# EasyEDA schematic SCH_PowerDistributionBoardV2_2022-03-02.json
TITLE: Sheet_1; REV: 1.0; Date: 2022-03-02; Sheet: 1/1; Drawn By: JunnH; Company: Your Company
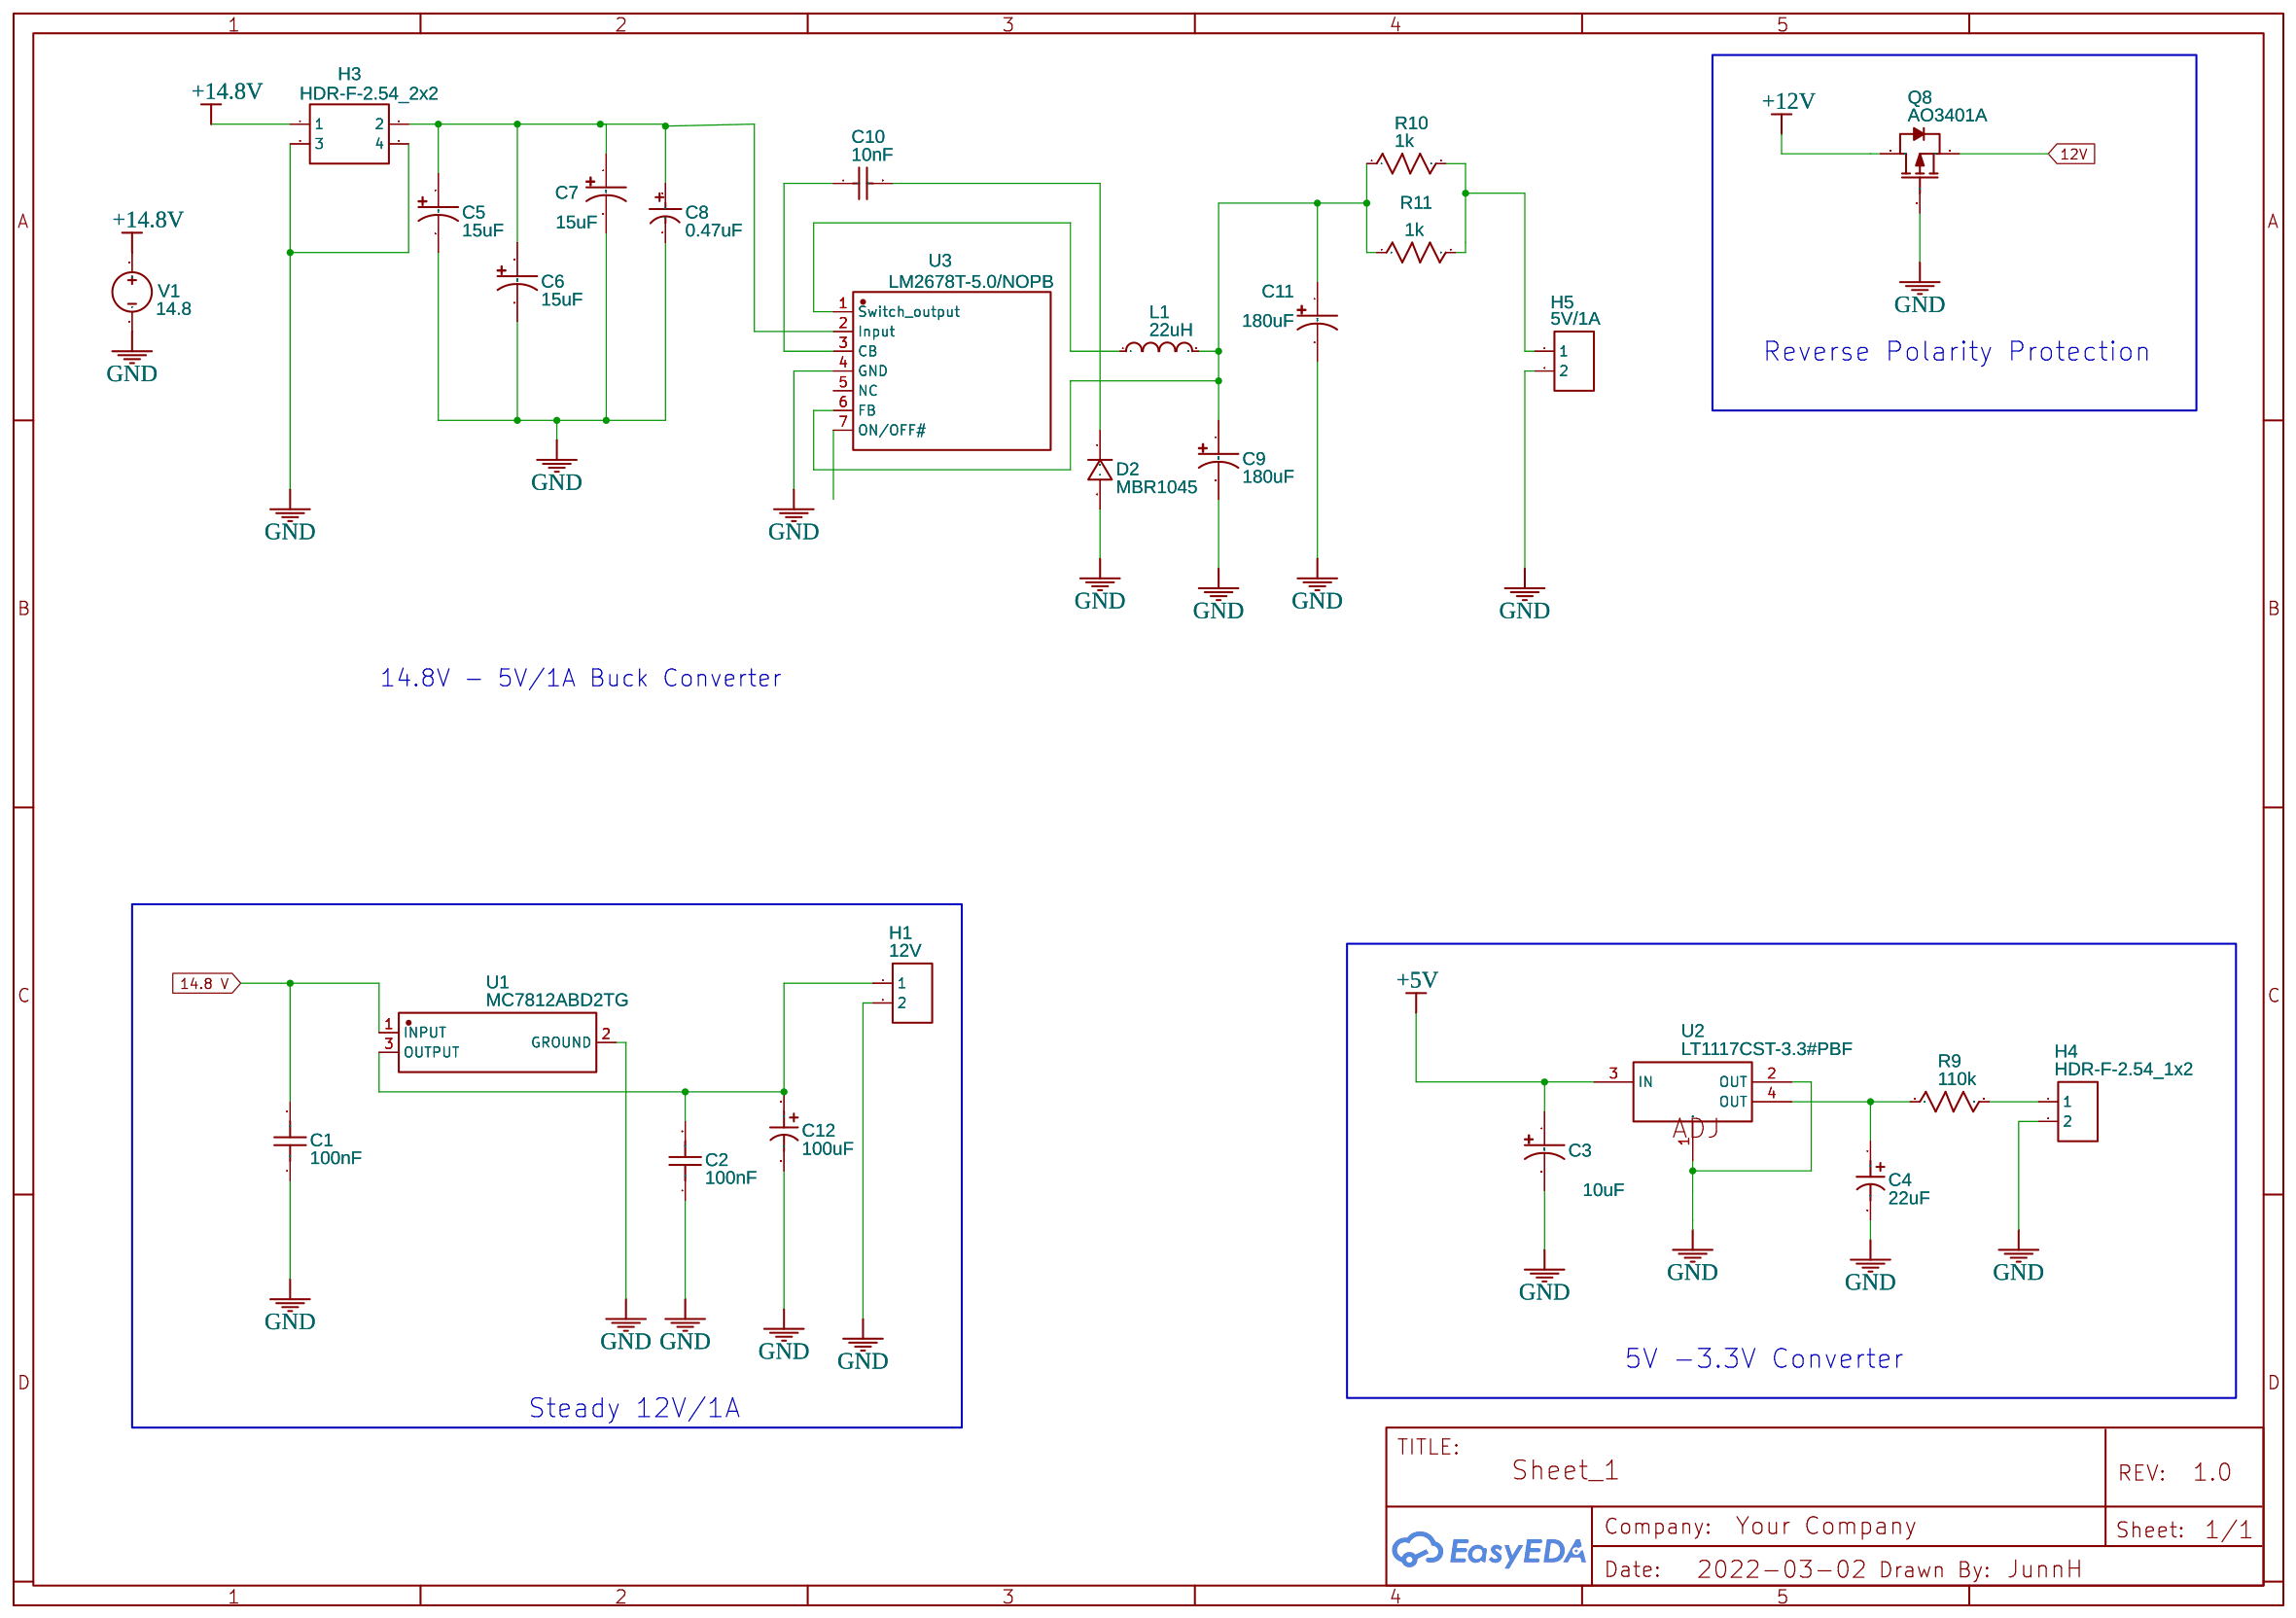
[diagram p0: schematic sheet]

## Parts
C1  100nF  [CAP-TH_L5.0-W2.5-P2.54-D0.7]
C2  100nF  [CAP-TH_L5.0-W2.5-P2.54-D0.7]
C3  10uF  [CAP-SMD_BD5.0-L5.3-W5.3-RD]
C4  22uF  [CAP-SMD_BD6.3-L6.6-W6.6-FD]
C5  15uF  [CAP-SMD_BD6.3-L6.6-W6.6-LS7.6-FD]
C6  15uF  [CAP-SMD_BD6.3-L6.6-W6.6-LS7.6-FD]
C7  15uF  [CAP-SMD_BD6.3-L6.6-W6.6-LS7.6-FD]
C8  0.47uF  [CAP-SMD_BD4.0-L4.3-W4.3-FD-LS5.3]
C9  180uF  [CAP-SMD_BD6.3-L6.6-W6.6-LS7.2-R-RD]
C10  10nF  [C0805]
C11  180uF  [CAP-SMD_BD6.3-L6.6-W6.6-LS7.2-R-RD]
C12  100uF  [CAP-SMD_BD6.3-L6.6-W6.6-LS7.4-FD]
D2  MBR1045  [TO-220AC_L10.0-W4.5-P5.08-T]
H1  12V  [HDR-F-2.54_1X2]
H3  HDR-F-2.54_2x2  [HDR-F-2.54_2X2]
H4  HDR-F-2.54_1x2  [HDR-F-2.54_1X2]
H5  5V/1A  [HDR-F-2.54_1X2]
L1  22uH  [IND-SMD_L7.1-W6.6]
Q8  AO3401A  [SOT-23_L2.9-W1.3-P1.90-LS2.4-BR]
R9  110k  [R0603]
R10  1k  [R0603]
R11  1k  [R0603]
U1  MC7812ABD2TG  [TO-263-2_L10.1-W9.1-P5.08-LS15.2-BR]
U2  LT1117CST-3.3#PBF  [SOT-223-3_L6.5-W3.4-P2.30-LS7.0-BR]
U3  LM2678T-5.0/NOPB  [TO-220-7-L10.5-W4.5-P1.27-BL]
V1  14.8  [HDR1X2]

## Library data of the parts
C1 C2 = CC1H104ZA19D3F5P10MF: Supplier: LCSC; Supplier Part: C254086; Manufacturer: Dersonic; Contributor: LCSC; JLCPCB Part Class: Extended Part
C3 = VE-100M1H0505-TRO: Supplier: LCSC; Supplier Part: C249452; Manufacturer: Lelon; Contributor: LCSC; JLCPCB Part Class: Extended Part
C4 = RVT22UF50V67RV0028: Supplier: LCSC; Supplier Part: C2836438; Manufacturer: KNSCHA(科尼盛); Contributor: LCSC
C5-C7 = UUD1H150MCL1GS: Supplier: LCSC; Supplier Part: C340748; Manufacturer: Nichicon; Contributor: LCSC; JLCPCB Part Class: Extended Part
C8 = CS1HR47M-CRC54: Supplier: LCSC; Manufacturer: SEMTECH; Contributor: LCSC; Supplier Part: C117834; JLCPCB Part Class: Extended Part
C9 C11 = VKMC1001C181MV: Supplier: LCSC; Supplier Part: C487303; Manufacturer: Ymin; Contributor: LCSC; JLCPCB Part Class: Extended Part
C10 = CL21B103KBANNNC: Supplier: LCSC; Manufacturer: SAMSUNG; Supplier Part: C1710; JLCPCB Part Class: Basic Part
C12 = RVT100UF35V67RV0034: Supplier: LCSC; Supplier Part: C2836442; Manufacturer: KNSCHA(科尼盛); Contributor: LCSC; JLCPCB Part Class: Extended Part
D2 = MBR1045: Supplier: LCSC; Supplier Part: C260253; Manufacturer: Sangdest Microelectronicstronic (Nanjing); Contributor: LCSC; JLCPCB Part Class: Extended Part
H1 H4 H5 = HDR-F-2.54_1x2: Supplier Part: C49661; Supplier: LCSC; Contributor: LCEDA_Lib
H3 = HDR-F-2.54_2x2: Supplier Part: C239342; Supplier: LCSC; Contributor: LCEDA_Lib
L1 = SLO0630H220MTT: Supplier: LCSC; Supplier Part: C207843; Manufacturer: Sunltech Tech; Contributor: LCSC; JLCPCB Part Class: Extended Part
Q8 = AO3401A: Supplier: LCSC; Manufacturer: AOS; Supplier Part: C15127; JLCPCB Part Class: Basic Part
R9-R11 = R_0603_US: Contributor: LCEDA_Lib
U1 = MC7812ABD2TG: Supplier: LCSC; Manufacturer: ON; Contributor: LCSC; Supplier Part: C154818; JLCPCB Part Class: Extended Part
U2 = LT1117CST-3.3#PBF: Supplier: LCSC; Supplier Part: C140395; Manufacturer: Linear Tech; Contributor: LCSC; JLCPCB Part Class: Extended Part
U3 = LM2678T-5.0/NOPB: Supplier: LCSC; Supplier Part: C390086; Manufacturer: Texas Instruments; Contributor: LCSC; JLCPCB Part Class: Extended Part
V1 = VDC: Contributor: EasyEDA; sim: true

## Nets
12V: Q8.2(S)
+5V: C3.1 U2.3(IN)
+12V: Q8.3(D)
+14.8V: H3.1 V1.1
GND: C1.1 C2.1 C3.2 C4.2 C5.2 C6.2 C7.2 C8.2 C9.2 C11.2 C12.2 D2.2(A) H1.2 H3.3 H3.4 H4.2 H5.2 Q8.1(G) U1.2(GROUND) U2.1(ADJ) U2.2(OUT) U3.4(GND) V1.2
14.8 V: C1.2 U1.1(INPUT)
Net-(C2-2): C2.2 C12.1 H1.1 U1.3(OUTPUT)
Net-(C4-1): C4.1 R9.1 U2.4(OUT)
Net-(C5-1): C5.1 C6.1 C7.1 C8.1 H3.2 U3.2(Input)
Net-(C9-1): C9.1 C11.1 L1.2 R10.1 R11.1 U3.6(FB)
Net-(C10-1): C10.1 U3.3(CB)
Net-(C10-2): C10.2 D2.1(C)
Net-(H4-1): H4.1 R9.2
Net-(H5-1): H5.1 R10.2 R11.2
Net-(L1-1): L1.1 U3.1(Switch_output)

Not connected (* = marked no-connect by the designer): U3 5(NC) 7(ON/OFF#)

## Notes on the sheet
- Reverse Polarity Protection
- 14.8V - 5V/1A Buck Converter
- 5V -3.3V Converter
- Steady 12V/1A
